# Altium project INDICATOR_MEZ.PrjPCB
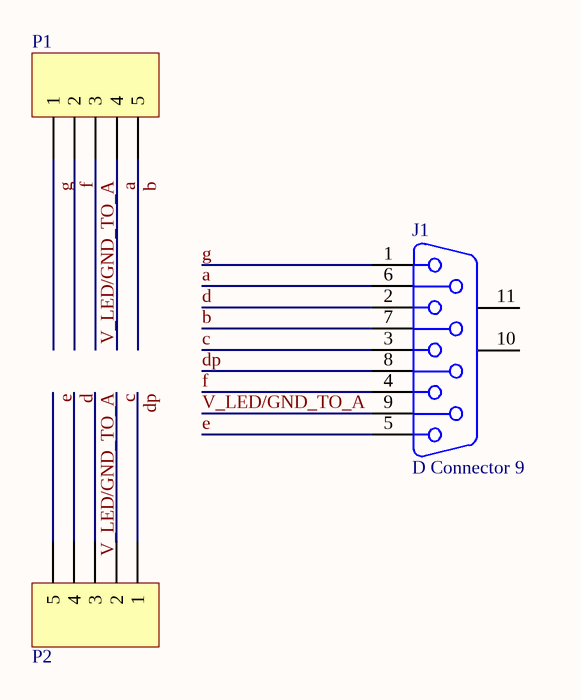
[diagram p0: INDICATOR_MEZ.SchDoc]
1 sheet, 3 parts. Net scope: global (net labels, ports and power ports of the same name join across sheets).
Board file: INDICATOR_MEZ.PcbDoc

## Sheet INDICATOR_MEZ.SchDoc
size A4

### Parts
J1  D Connector 9  [DSUB1.385-2H9]
P1  Header 5  [HDR1X5]  (value not drawn)
P2  Header 5  [HDR1X5]  (value not drawn)

### Nets
a: J1.6 P1.4
b: J1.7 P1.5
c: J1.3 P2.2
d: J1.2 P2.4
dp: J1.8 P2.1
e: J1.5 P2.5
f: J1.4 P1.2
g: J1.1 P1.1
V_LED/GND_TO_A: J1.9 P1.3 P2.3

Not connected (* = marked no-connect by the designer): J1 10(MH1) 11(MH2)

### Library data of the parts
J1 = D Connector 9: Receptacle Assembly, 9 Position, Right Angle; PackageDocument: O; Positions: 9; Published: 15-Jun-2001; LatestRevisionDate: 17-Jul-2002; LatestRevisionNote: Re-released for DXP Platform.; DatasheetDocument: 1-Sep-1999; PackageReference: 788750; Publisher: Altium Limited; Orientation: Right Angle; Gender: Receptacle
P1 P2 = Header 5: Header, 5-Pin; LatestRevisionDate: 17-Jul-2002; LatestRevisionNote: Re-released for DXP Platform.; Publisher: Altium Limited